# Altium schematic sheet Keyboard.SchDoc: Lab. Proj. PCB
size A4; Author: Tomasz Machnik; Revision: 1; SheetNumber: 3; SheetTotal: 7
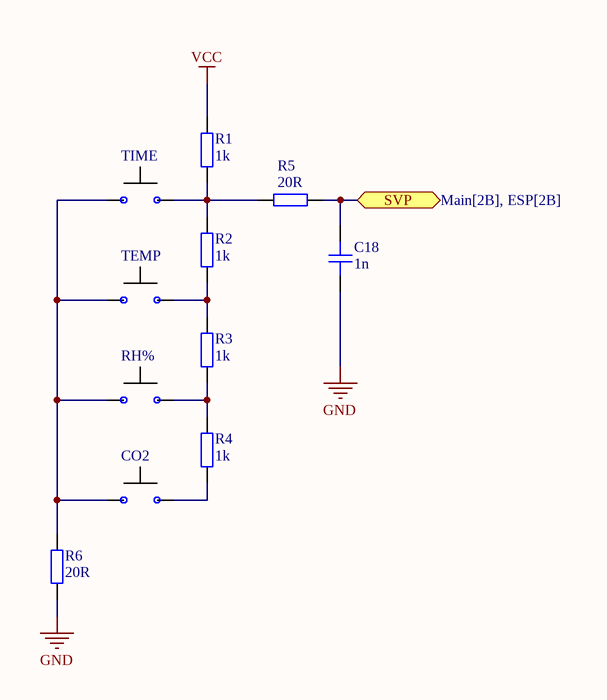
[diagram p0: Keyboard.SchDoc]

## Parts
C18  1n  [CAP_0805]
CO2  Tact_Switch  [Tact_Switch]  (value not drawn)
R1  1k  [RES_0805]
R2  1k  [RES_0805]
R3  1k  [RES_0805]
R4  1k  [RES_0805]
R5  20R  [RES_0805]
R6  20R  [RES_0805]
RH%  Tact_Switch  [Tact_Switch]  (value not drawn)
TEMP  Tact_Switch  [Tact_Switch]  (value not drawn)
TIME  Tact_Switch  [Tact_Switch]  (value not drawn)

## Ports
SVP (bidir, see Main[2B], ESP[2B])

## Nets
GND: C18.1 R6.1
VCC: R1.2
SVP: C18.2 R5.1 ; port SVP
NetCO2_1: CO2.1(PIN) R6.2 RH%.1(PIN) TEMP.1(PIN) TIME.1(PIN)
NetCO2_2: CO2.2(PIN) R4.1
NetR1_1: R1.1 R2.2 R5.2 TIME.2(PIN)
NetR2_1: R2.1 R3.2 TEMP.2(PIN)
NetR3_1: R3.1 R4.2 RH%.2(PIN)

## Notes on the sheet
- Title:
- Author:
- Approved:
- Size:
- Date:
- Git Hash:
- A4
- Prj:
- SW Version:
- Variant:
- Edited:
- CONFIDENTIAL
- File:

## Library data of the parts
C18 = CAP_0805: Capacitor SMD 0805; Manufacturer: *; Manufacturer Part Number: *; Distributor Link: *; LCSC: *; Rating: *; Dielectric: *
R1-R6 = RES_0805: Resistor SMD 0805; Manufacturer: *; Manufacturer Part Number: *; Distributor Link: *; LCSC: *